# Altium schematic sheet CAMERON.SchDoc
size Letter; Organization: Altium Limited; Address1: L3, 12a Rodborough Rd; Address2: Frenchs Forest; Address3: NSW; Address4: Australia 2086
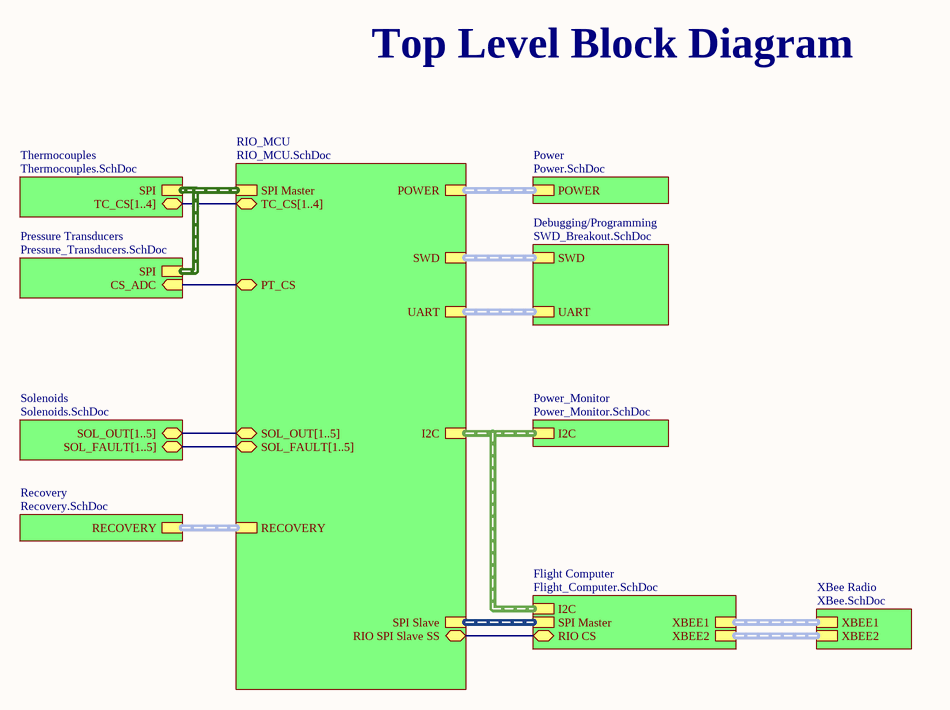
[diagram p0: CAMERON.SchDoc]

## Sub-sheets
Debugging/Programming = SWD_Breakout.SchDoc: SWD (harness SWD), UART (harness UART)
Flight Computer = Flight_Computer.SchDoc: SPI Master (harness SPI), RIO CS (bidir), I2C (harness I2C), XBEE2 (harness UART), XBEE1 (harness UART)
Power = Power.SchDoc: POWER (harness POWER)
Power_Monitor = Power_Monitor.SchDoc: I2C (harness I2C)
Pressure Transducers = Pressure_Transducers.SchDoc: SPI (harness SPI), CS_ADC (in)
Recovery = Recovery.SchDoc: RECOVERY (harness RECOVERY)
RIO_MCU = RIO_MCU.SchDoc: I2C (harness I2C), SPI Master (harness SPI), SWD (harness SWD), POWER (harness POWER), TC_CS[1..4] (bidir), SPI Slave (harness SPI), RIO SPI Slave SS (bidir), SOL_OUT[1..5] (bidir), SOL_FAULT[1..5] (bidir), PT_CS (bidir), UART (harness UART), RECOVERY (harness RECOVERY)
Solenoids = Solenoids.SchDoc: SOL_OUT[1..5] (bidir), SOL_FAULT[1..5] (bidir)
Thermocouples = Thermocouples.SchDoc: SPI (harness SPI), TC_CS[1..4] (bidir)
XBee Radio = XBee.SchDoc: XBEE2 (harness UART), XBEE1 (harness UART)

## Nets
(unnamed): sheet RIO_MCU/RIO SPI Slave SS, sheet Flight Computer/RIO CS
(unnamed): sheet RIO_MCU/PT_CS, sheet Pressure Transducers/CS_ADC

## Buses and harness runs
bus sheet RIO_MCU/SOL_FAULT[1..5] = sheet Solenoids/SOL_FAULT[1..5]
bus sheet RIO_MCU/SOL_OUT[1..5] = sheet Solenoids/SOL_OUT[1..5]
bus sheet RIO_MCU/TC_CS[1..4] = sheet Thermocouples/TC_CS[1..4]
harness sheet Debugging/Programming/SWD = sheet RIO_MCU/SWD
harness sheet Debugging/Programming/UART = sheet RIO_MCU/UART
harness sheet Flight Computer/I2C = sheet Power_Monitor/I2C = sheet RIO_MCU/I2C
harness sheet Flight Computer/SPI Master = sheet RIO_MCU/SPI Slave
harness sheet Flight Computer/XBEE1 = sheet XBee Radio/XBEE1
harness sheet Flight Computer/XBEE2 = sheet XBee Radio/XBEE2
harness sheet Power/POWER = sheet RIO_MCU/POWER
harness sheet Pressure Transducers/SPI = sheet RIO_MCU/SPI Master = sheet Thermocouples/SPI
harness sheet Recovery/RECOVERY = sheet RIO_MCU/RECOVERY

## Notes on the sheet
- Top Level Block Diagram
- Title
- Size:
- Date:
- Letter
- Number:
- Time:
- Revision:
- Sheet
- of
- File: